# Altium schematic sheet Bpod Input.SchDoc
size 297 x 209 mm; CompanyName: Sainsbury Wellcome Centre; Organization: FabLab; Address1: Sainsbury Wellcome Centre; Address2: 25 Howland Street; Address3: London; Address4: W1T 4JG; DocumentNumber: 2; SheetNumber: 2; SheetTotal: 12; swcgroup: FabLab; Org: Sainsbury Wellcome Centre; Add1: 25 Howland Street; Add2: London; Add3: W1T 4JG; WebAddress: www.sainsburywellcome.org; SheetSize: A4; SheetName: Level Shifter
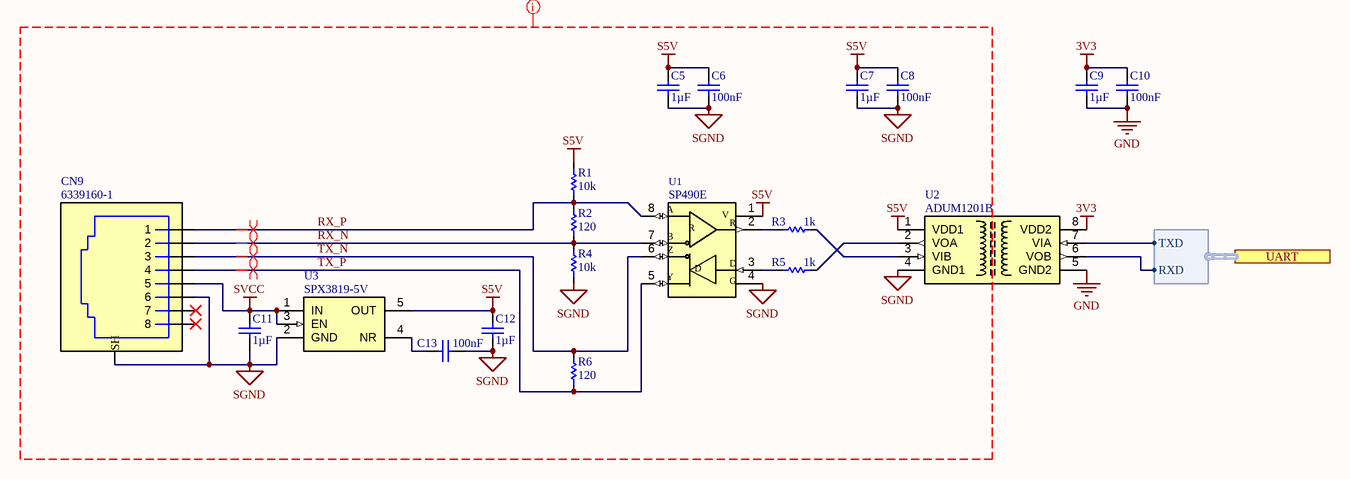
[diagram p0: Bpod Input.SchDoc]

## Parts
C5  value 1µF  [CAP_CHIP_0603]  (hidden comment: C0603-1uF-50V)
C6  value 100nF  [CAP_CHIP_0603]  (hidden comment: C0603-100nF-50V)
C7  value 1µF  [CAP_CHIP_0603]  (hidden comment: C0603-1uF-50V)
C8  value 100nF  [CAP_CHIP_0603]  (hidden comment: C0603-100nF-50V)
C9  value 1µF  [CAP_CHIP_0603]  (hidden comment: C0603-1uF-50V)
C10  value 100nF  [CAP_CHIP_0603]  (hidden comment: C0603-100nF-50V)
C11  value 1µF  [CAP_CHIP_0603]  (hidden comment: C0603-1uF-50V)
C12  value 1µF  [CAP_CHIP_0603]  (hidden comment: C0603-1uF-50V)
C13  value 100nF  [CAP_CHIP_0603]  (hidden comment: C0603-100nF-50V)
CN9  RJ45-6339160-1  [6339160-1]  (value not drawn)
R1  value 10k  [RES_CHIP_0603]  (hidden comment: R0603-10K)
R2  value 120  [RES_CHIP_0603]  (hidden comment: R0603-120R)
R3  value 1k  [RES_CHIP_0603]  (hidden comment: R0603-1K)
R4  value 10k  [RES_CHIP_0603]  (hidden comment: R0603-10K)
R5  value 1k  [RES_CHIP_0603]  (hidden comment: R0603-1K)
R6  value 120  [RES_CHIP_0603]  (hidden comment: R0603-120R)
U1  SP490E  [SOIC8]
U2  ADUM1201B  [SOIC8]
U3  SPX3819-5V  [SOT23-5]

## Ports
UART (harness UART)

## Harnesses
UART: RXD, TXD

## Nets
3V3: C9.2 C10.2 U2.8(VDD2)
GND: C9.1 C10.1 U2.5(GND2)
S5V: C5.2 C6.2 C7.2 C8.2 C12.2 R1.2 U1.1(V) U2.1(VDD1) U3.5(OUT)
SGND: C5.1 C6.1 C7.1 C8.1 C11.1 C12.1 C13.1 CN9.0(SH) CN9.6 R4.1 U1.4(G) U2.4(GND1) U3.2(GND)
SVCC: C11.2 CN9.5 U3.1(IN) U3.3(EN)
RX_N: CN9.2 R2.1 R4.2 U1.7(B)
RX_P: CN9.1 R1.1 R2.2 U1.8(A)
TX_N: CN9.3 R6.2 U1.6(Z)
TX_P: CN9.4 R6.1 U1.5(Y)
NetC13_2: C13.2 U3.4(NR)
NetR3_1: R3.1 U1.2(R)
NetR3_2: R3.2 U2.3(VIB)
NetR5_1: R5.1 U1.3(D)
NetR5_2: R5.2 U2.2(VOA)
NetU2_6: U2.6(VOB) ; port UART.RXD
NetU2_7: U2.7(VIA) ; port UART.TXD

Not connected (* = marked no-connect by the designer): CN9 7* 8*

## Layout directives
mark named Isolated IO: RX_N, RX_P, S5V, SGND, SVCC, TX_N, TX_P
differential pair; differential pair class RS422: RX_N, RX_P, TX_N, TX_P

## Notes on the sheet
- FILE
- VARIANT
- DATE
- REVISION
- SHEET
- /
- PROJECT
- SIZE

## Library data of the parts
C5 C7 C9 C11 C12 = CMP-611-0033-11: 0603 Multilayer Ceramic Capacitors MLCC; PartNumber: CL10A105KB8NNNC; Pick&PlaceFootprint: C0603; Voltage Rating: 50V; Dielectric: X5R; Tolerance: 10%; Case/Package: 0603; RoHS: Yes; Capacitor Type: Ceramic; Mount: SMD; LCSC Part N.: C15849
C6 C8 C10 C13 = CMP-611-0027-24: 0603 Multilayer Ceramic Capacitors MLCC; PartNumber: CC0603KRX7R9BB104; Pick&PlaceFootprint: C0603; Dielectric: X7R; Voltage Rating: 50V; Tolerance: 10%; Case/Package: 0603; Capacitor Type: Ceramic; LCSC Part N.: C14663; Mount: SMD; RoHS: Yes
CN9 = CMP-390-0000-8: CONN MOD JACK 8P8C R/A SHIELDED; Pitch: 1.02mm; Element Configuration: Single; Gender: Female; Number of Contacts: 8; LCSC Part N.: C125076; Shielding: Shielded; Orientation: Right Angle; PartNumber: 6339160-1; Termination: SMD/SMT
R1 R4 = CMP-633-0002-26: 100mW Thick Film Resistors 75V ±100ppm/℃ ±1% 0603 Chip Resistor; PartNumber: 0603WAF1002T5E; Number of Resistors: 1; Pick&PlaceFootprint: R0603; Case/Package: 0603; Voltage Rating: 75V; Power Rating: 100mW; LCSC Part N.: C25804; Tolerance: 1%; Mount: Surface Mount
R2 R6 = CMP-633-0100-12: 100mW Thick Film Resistors 75V ±100ppm/℃ ±1% 0603 Chip Resistor; PartNumber: 0603WAF1200T5E; Pick&PlaceFootprint: R0603; Number of Resistors: 1; Mount: Surface Mount; Tolerance: 1%; Voltage Rating: 75V; Case/Package: 0603; Power Rating: 100mW; LCSC Part N.: C22787
R3 R5 = CMP-633-0013-26: 100mW Thick Film Resistors 75V ±100ppm/℃ ±1% 0603 Chip Resistor; PartNumber: 0603WAF1001T5E; Pick&PlaceFootprint: R0603; Number of Resistors: 1; Voltage Rating: 75V; Case/Package: 0603; Tolerance: 1%; Mount: Surface Mount; LCSC Part N.: C21190; Power Rating: 100mW
U1 = CMP-930-0018-1: TRANSCEIVER RS485, SMD, NSOIC8, 5V; Device Type: Line Driver / Receiver; IC Interface Type: RS422, RS485; No. of...; PartNumber: SP490EEN; Data Rate: 10Mbps; Simplex/Duplex: Full Duplex; LCSC Part N.: C19128
U2 = CMP-930-0008-4: General Purpose Digital Isolator 2500Vrms 2 Channel 10Mbps 25kV/µs CMTI 8-SOIC (0.154; PartNumber: ADUM1201BRZ-RL7; Max Supply Voltage: 5.5V; Data Rate: 25Mbps; Min Supply Voltage: 2.7V; LCSC Part N.: C87626; Pick&PlaceFootprint: SOIC8
U3 = CMP-970-0066-1: 500mA 70dB Fixed 3.3V Positive electrode 16V LDO; PartNumber: SPX3819M5-L-5-0/TR; Accuracy: 1%; Max Output Current: 800mA; Min Input Voltage: 2.5V; Output Noise: 40uV; Load Regulation: 0.05%; Output Voltage: 5V; Dropout Voltage: 340mV; Quiescent Current: 8uA; Line Regulation: 0.04%; Max Supply Voltage: 16V; PSRR: 70dB; Max Input Voltage: 16V; Output Current: 500mA; LCSC Part N.: C13417; Output Type: Fixed; Pick&PlaceFootprint: SOT23-5